# EAGLE schematic flex_conn_v5 (EAGLE 6.6.0)
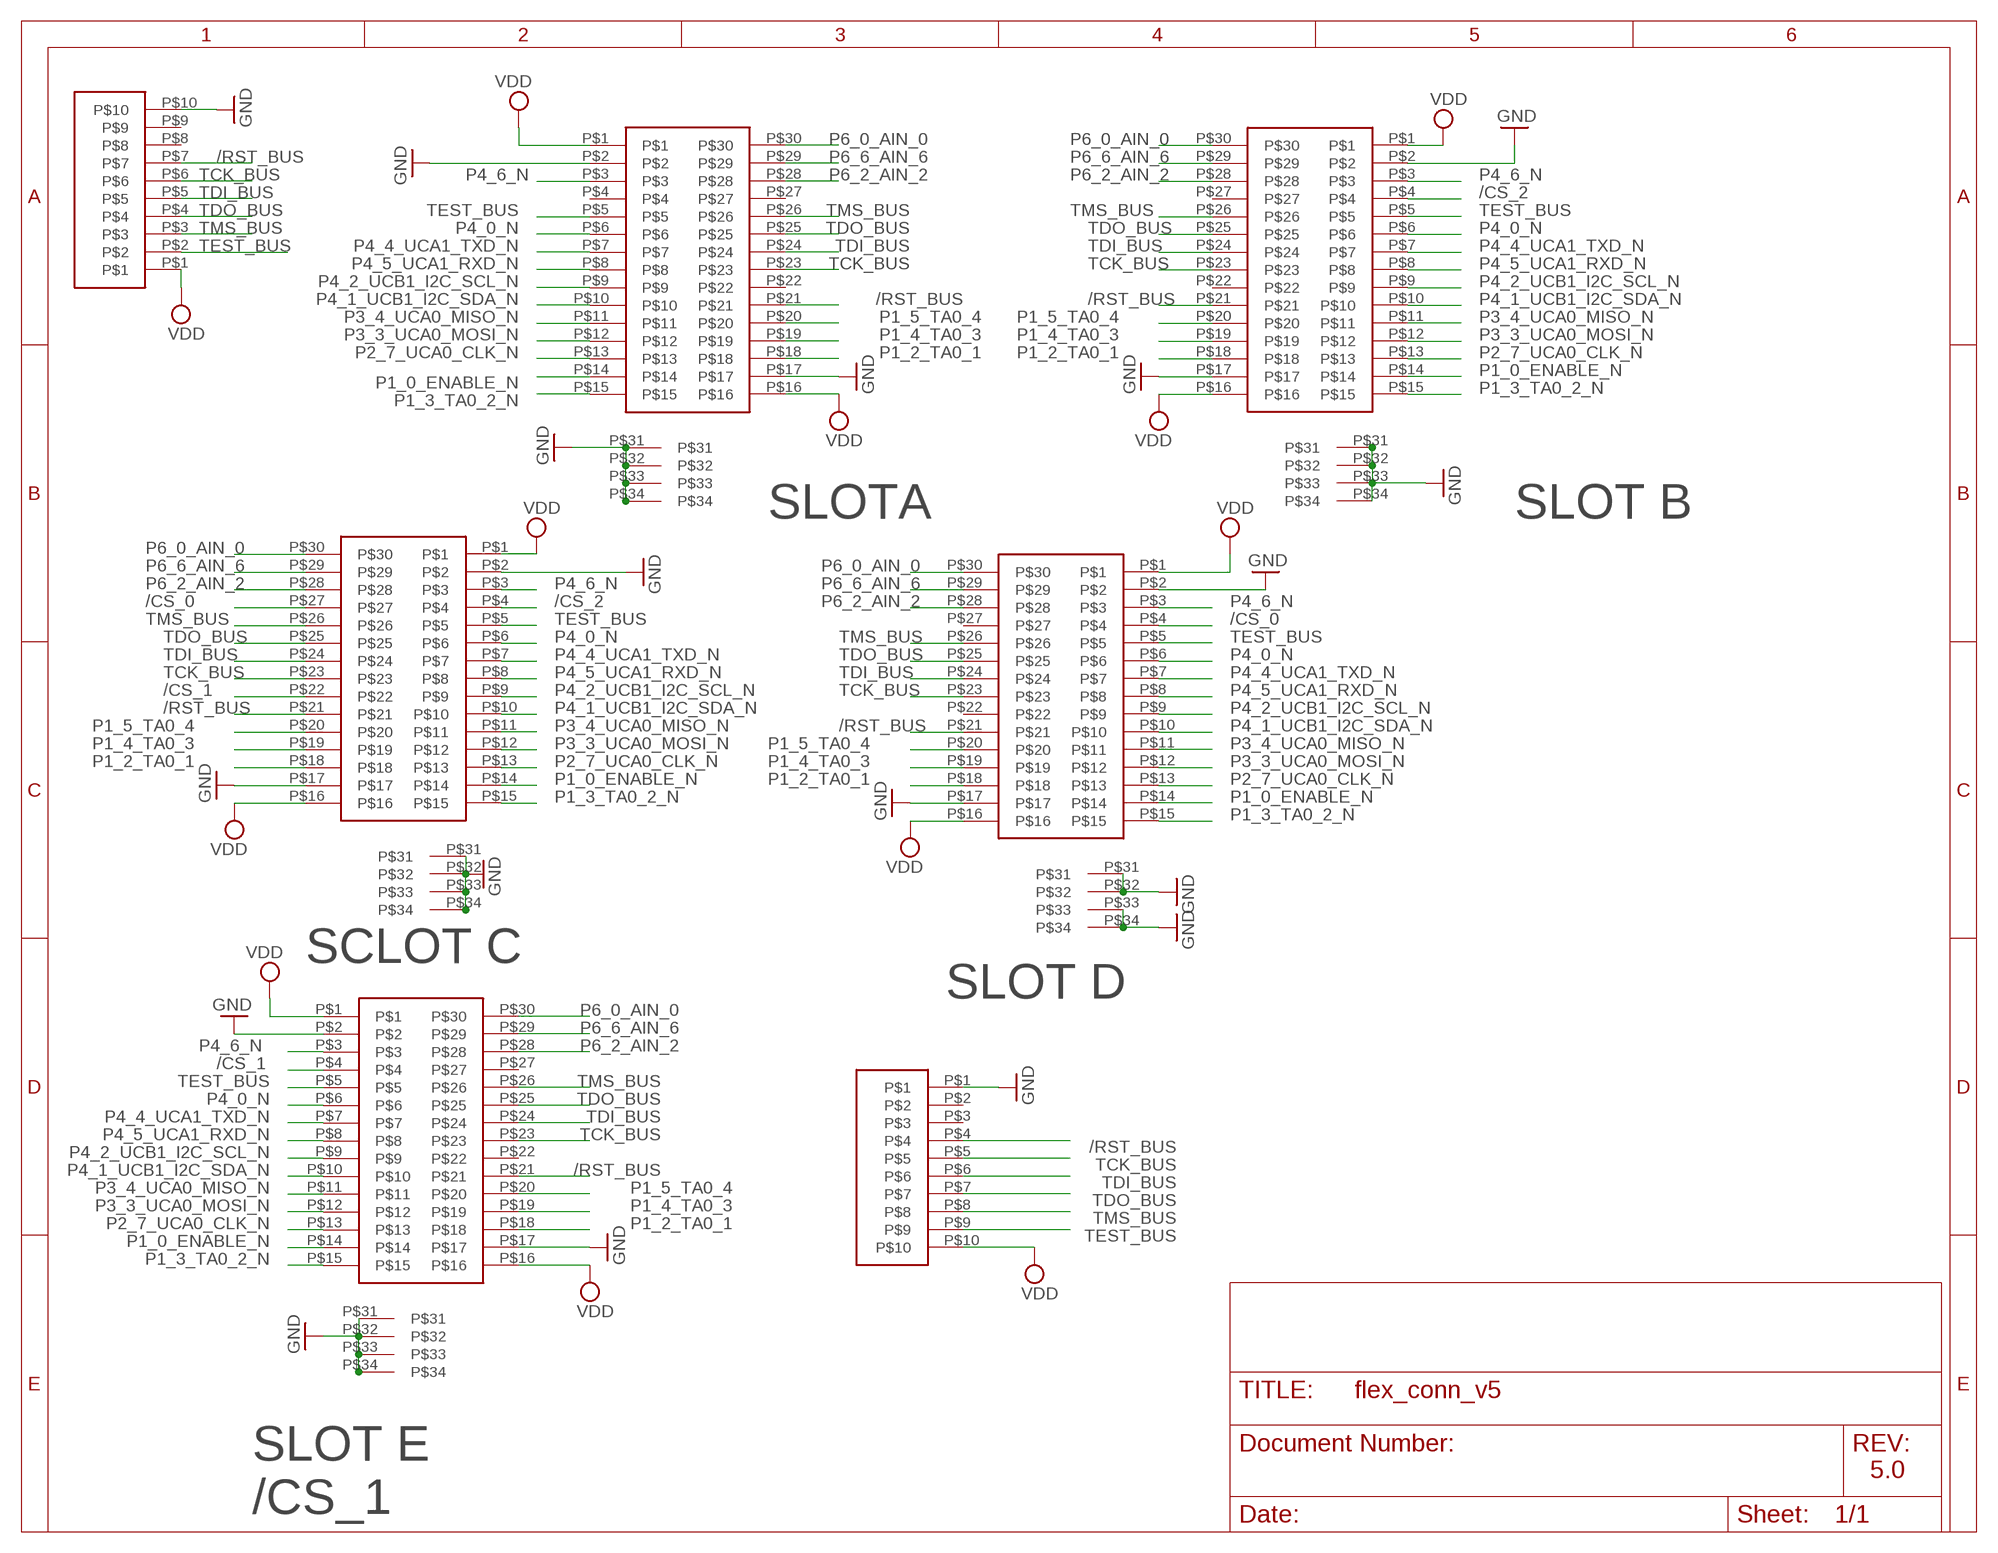
[diagram p0: schematic, sheet 1]

## Parts
U$1  500913-0302_REC_30CONN_2  [500913-0302_REC_30CONN_2]
U$2  500913-0302_REC_30CONN_2  [500913-0302_REC_30CONN_2]
U$3  500913-0302_REC_30CONN_2  [500913-0302_REC_30CONN_2]
U$4  500913-0302_REC_30CONN_2  [500913-0302_REC_30CONN_2]
U$5  CABLE_ADAPTATOR  [FPC_FFC]
U$6  500913-0302_REC_30CONN_2  [500913-0302_REC_30CONN_2]
U$7  CABLE_ADAPTATOR  [FPC_FFC]

## Nets
/CS_0: U$1.P$4 U$6.P$27
/CS_1: U$4.P$4 U$6.P$22
/CS_2: U$2.P$4 U$6.P$4
/RST_BUS: U$1.P$21 U$2.P$21 U$3.P$21 U$4.P$21 U$5.P$7 U$6.P$21 U$7.P$4
GND: U$1.P$2 U$1.P$17 U$1.P$31 U$1.P$32 U$1.P$33 U$1.P$34 U$2.P$2 U$2.P$17 U$2.P$31 U$2.P$32 U$2.P$33 U$2.P$34 U$3.P$2 U$3.P$17 U$3.P$31 U$3.P$32 U$3.P$33 U$3.P$34 U$4.P$2 U$4.P$17 U$4.P$31 U$4.P$32 U$4.P$33 U$4.P$34 U$5.P$10 U$6.P$2 U$6.P$17 U$6.P$31 U$6.P$32 U$6.P$33 U$6.P$34 U$7.P$1
P1_0_ENABLE_N: U$1.P$14 U$2.P$14 U$3.P$14 U$4.P$14 U$6.P$14
P1_2_TA0_1: U$1.P$18 U$2.P$18 U$3.P$18 U$4.P$18 U$6.P$18
P1_3_TA0_2_N: U$1.P$15 U$2.P$15 U$3.P$15 U$4.P$15 U$6.P$15
P1_4_TA0_3: U$1.P$19 U$2.P$19 U$3.P$19 U$4.P$19 U$6.P$19
P1_5_TA0_4: U$1.P$20 U$2.P$20 U$3.P$20 U$4.P$20 U$6.P$20
P2_7_UCA0_CLK_N: U$1.P$13 U$2.P$13 U$3.P$13 U$4.P$13 U$6.P$13
P3_3_UCA0_MOSI_N: U$1.P$12 U$2.P$12 U$3.P$12 U$4.P$12 U$6.P$12
P3_4_UCA0_MISO_N: U$1.P$11 U$2.P$11 U$3.P$11 U$4.P$11 U$6.P$11
P4_0_N: U$1.P$6 U$2.P$6 U$3.P$6 U$4.P$6 U$6.P$6
P4_1_UCB1_I2C_SDA_N: U$1.P$10 U$2.P$10 U$3.P$10 U$4.P$10 U$6.P$10
P4_2_UCB1_I2C_SCL_N: U$1.P$9 U$2.P$9 U$3.P$9 U$4.P$9 U$6.P$9
P4_4_UCA1_TXD_N: U$1.P$7 U$2.P$7 U$3.P$7 U$4.P$7 U$6.P$7
P4_5_UCA1_RXD_N: U$1.P$8 U$2.P$8 U$3.P$8 U$4.P$8 U$6.P$8
P4_6_N: U$1.P$3 U$2.P$3 U$3.P$3 U$4.P$3 U$6.P$3
P6_0_AIN_0: U$1.P$30 U$2.P$30 U$3.P$30 U$4.P$30 U$6.P$30
P6_2_AIN_2: U$1.P$28 U$2.P$28 U$3.P$28 U$4.P$28 U$6.P$28
P6_6_AIN_6: U$1.P$29 U$2.P$29 U$3.P$29 U$4.P$29 U$6.P$29
TCK_BUS: U$1.P$23 U$2.P$23 U$3.P$23 U$4.P$23 U$5.P$6 U$6.P$23 U$7.P$5
TDI_BUS: U$1.P$24 U$2.P$24 U$3.P$24 U$4.P$24 U$5.P$5 U$6.P$24 U$7.P$6
TDO_BUS: U$1.P$25 U$2.P$25 U$3.P$25 U$4.P$25 U$5.P$4 U$6.P$25 U$7.P$7
TEST_BUS: U$1.P$5 U$2.P$5 U$3.P$5 U$4.P$5 U$5.P$2 U$6.P$5 U$7.P$9
TMS_BUS: U$1.P$26 U$2.P$26 U$3.P$26 U$4.P$26 U$5.P$3 U$6.P$26 U$7.P$8
VDD: U$1.P$1 U$1.P$16 U$2.P$1 U$2.P$16 U$3.P$1 U$3.P$16 U$4.P$1 U$4.P$16 U$5.P$1 U$6.P$1 U$6.P$16 U$7.P$10
Unconnected: U$1.P$22 U$1.P$27 U$2.P$22 U$2.P$27 U$3.P$4 U$3.P$22 U$3.P$27 U$4.P$22 U$4.P$27 U$5.P$8 U$5.P$9 U$7.P$2 U$7.P$3

## Notes on the sheet
- SLOTA | SLOT B
- SCLOT C
- SLOT D
- SLOT E
- 5.0
- /CS_1

## Library data of the parts
U$1-U$4 U$6 = Molex_SlimStack:500913-0302_REC_30CONN_2
U$5 U$7 = FPC_FFC_Cable:CABLE_ADAPTATOR